# Altium project charging-module.PrjPcb
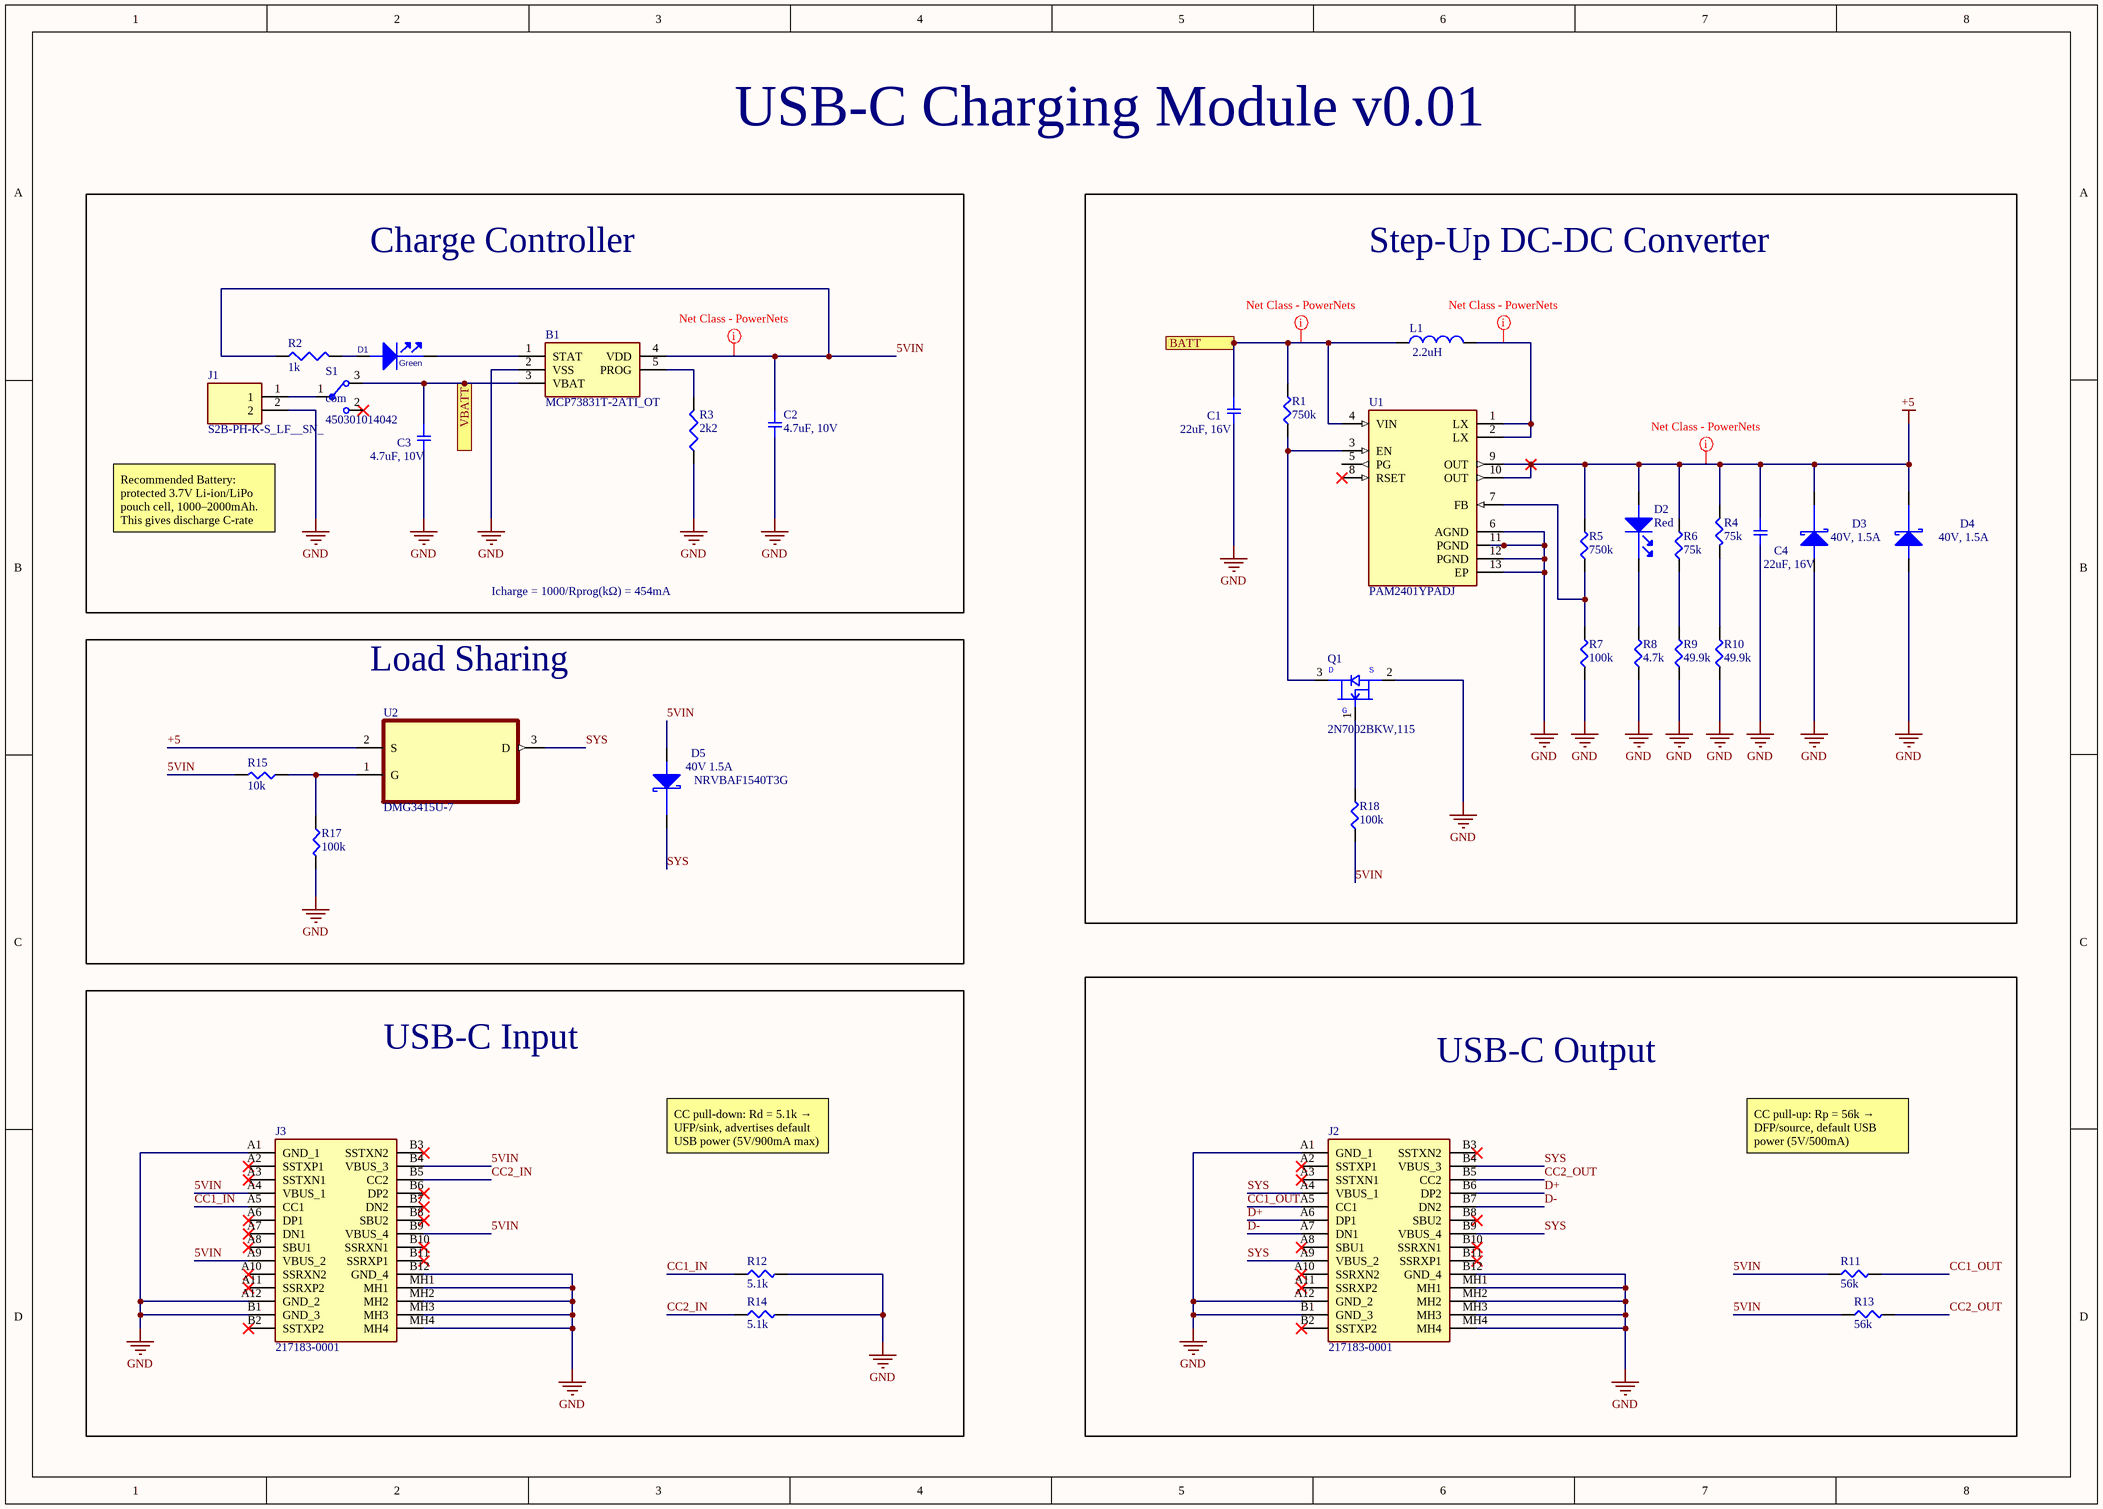
[diagram p0: charging-module.SchDoc]
1 sheet, 35 parts. Net scope: flat (ports and power ports of the same name join across sheets).
Board file: charging-module.PcbDoc

## Sheet charging-module.SchDoc
size A3; SheetNumber: 1; SheetTotal: 1

### Parts
B1  MCP73831T-2ATI_OT  [SOT95P270X145-5N]
C1  22uF, 16V  [SMD-1206C]
C2  4.7uF, 10V  [SMD-0603C]
C3  4.7uF, 10V  [SMD-0603C]
C4  22uF, 16V  [SMD-1206C]
D1  Green  [LED_0603]
D2  Red  [LED_0603]
D3  40V, 1.5A  [SMC]
D4  40V, 1.5A  [SMC]
D5  40V 1.5A  Supplier Part Number 1: NRVBAF1540T3G  [SMC]
J1  S2B-PH-K-S_LF__SN_  [SHDRRA2W50P0X200_1X2_590X760X480P]
J2  217183-0001  [2171830001]
J3  217183-0001  [2171830001]
L1  2.2uH  [INDPM7265X300N]
Q1  2N7002BKW,115  [SC70_SOT323]
R1  750k  [SMD-0402-RES]
R2  1k  [R0402]
R3  2k2  [R0402]
R4  75k  [SMD-0603-RES]
R5  750k  [SMD-0402-RES]
R6  75k  [SMD-0603-RES]
R7  100k  [SMD-0603-RES]
R8  4.7k  [SMD-0603-RES]
R9  49.9k  [SMD-0603-RES]
R10  49.9k  [SMD-0603-RES]
R11  56k  [SMD-0402-RES]
R12  5.1k  [R0402]
R13  56k  [SMD-0402-RES]
R14  5.1k  [R0402]
R15  10k  [SMD-0201-RES]
R17  100k  [SMD-0603-RES]
R18  100k  [SMD-0603-RES]
S1  450301014042  [450301014042]
U1  PAM2401YPADJ  [SON45P300X300X63-13N]
U2  DMG3415U-7  [SOT95P240X105-3N]

### Blocks framed on the sheet
Charge Controller: B1 C2 C3 D1 J1 R2 R3 S1
Step-Up DC-DC Converter: C1 C4 D2-D4 L1 Q1 R1 R4-R10 R18 U1
Load Sharing: D5 R15 R17 U2
USB-C Input: J3 R12 R14
USB-C Output: J2 R11 R13

### Ports
BATT, VBATT

### Nets
+5: C4.1 D2.2(ANODE) D3.1(cathode) D4.1(cathode) R4.1 R5.2 R6.2 U1.9(OUT) U1.10(OUT) U2.2(S)
GND: B1.2(VSS) C1.2 C2.2 C3.2 C4.2 D3.2(ANODE) D4.2(ANODE) J1.2 J2.A1(GND_1) J2.A12(GND_2) J2.B1(GND_3) J2.B12(GND_4) J2.MH1 J2.MH2 J2.MH3 J2.MH4 J3.A1(GND_1) J3.A12(GND_2) J3.B1(GND_3) J3.B12(GND_4) J3.MH1 J3.MH2 J3.MH3 J3.MH4 Q1.2(SOURCE) R3.1 R7.1 R8.1 R9.1 R10.1 R12.2 R14.2 R17.2 U1.6(AGND) U1.11(PGND) U1.12(PGND) U1.13(EP)
5VIN: B1.4(VDD) C2.1 D5.2(ANODE) J3.A4(VBUS_1) J3.A9(VBUS_2) J3.B4(VBUS_3) J3.B9(VBUS_4) R2.1 R11.1 R13.1 R15.2 R18.1
CC1_IN: J3.A5(CC1) R12.1
CC1_OUT: J2.A5(CC1) R11.2
CC2_IN: J3.B5(CC2) R14.1
CC2_OUT: J2.B5(CC2) R13.2
D+: J2.A6(DP1) J2.B6(DP2)
D-: J2.A7(DN1) J2.B7(DN2)
SYS: D5.1(cathode) J2.A4(VBUS_1) J2.A9(VBUS_2) J2.B4(VBUS_3) J2.B9(VBUS_4) U2.3(D)
NetB1_1: B1.1(STAT) D1.1(cathode)
NetB1_3: B1.3(VBAT) C3.1 S1.3 ; port VBATT
NetB1_5: B1.5(PROG) R3.2
NetC1_1: C1.1 L1.1 R1.2 U1.4(VIN) ; port BATT
NetD1_2: D1.2(ANODE) R2.2
NetD2_1: D2.1(cathode) R8.2
NetJ1_1: J1.1 S1.1
NetL1_2: L1.2 U1.1(LX) U1.2(LX)
NetQ1_1: Q1.1(GATE) R18.2
NetQ1_3: Q1.3(DRAIN) R1.1 U1.3(EN)
NetR4_2: R4.2 R10.2
NetR5_1: R5.1 R7.2 U1.7(FB)
NetR6_1: R6.1 R9.2
NetR15_1: R15.1 R17.1 U2.1(G)

Not connected (* = marked no-connect by the designer): J2 A2(SSTXP1)* A3(SSTXN1)* A8(SBU1)* A10(SSRXN2)* A11(SSRXP2)* B2(SSTXP2)* B3(SSTXN2)* B8(SBU2)* B10(SSRXN1)* B11(SSRXP1)*; J3 A2(SSTXP1)* A3(SSTXN1)* A6(DP1)* A7(DN1)* A8(SBU1)* A10(SSRXN2)* A11(SSRXP2)* B2(SSTXP2)* B3(SSTXN2)* B6(DP2)* B7(DN2)* B8(SBU2)* B10(SSRXN1)* B11(SSRXP1)*; S1 2*; U1 5(PG) 8(RSET)*

### Layout directives
mark named Net Class - PowerNets: 5VIN, +5, NetC1_1, NetL1_2

### Notes on the sheet
- USB-C Charging Module v0.01
- Recommended Battery: protected 3.7V Li-ion/LiPo pouch cell, 1000–2000mAh. This gives discharge C-rate around 0.75C to 1.5C
- Icharge = 1000/Rprog(kΩ) = 454mA
- CC pull-down: Rd = 5.1k → UFP/sink, advertises default USB power (5V/900mA max)
- CC pull-up: Rp = 56k → DFP/source, default USB power (5V/500mA)
- (in symbol 2N7002BKW,115) D; S; G
- (in symbol 450301014042) com

### Library data of the parts
B1 = MCP73831T-2ATI_OT: Microchip MCP73831T-2ATI/OT, Battery Charge Controller Lithium-Ion/Polymer, 500mA, 5-pin SOT-23; Geometry.Height: 1.45mm; Manufacturer_Name: Microchip; Manufacturer_Part_Number: MCP73831T-2ATI/OT; Mouser Part Number: 579-MCP73831T-2ATIOT; Mouser Price/Stock: https://www.mouser.co.uk/ProductDetail/Microchip-Technology/MCP73831T-2ATI-OT?qs=yUQqVecv4qsZbioEUu%252B83g%3D%3D; Arrow Part Number: MCP73831T-2ATI/OT; Arrow Price/Stock: https://www.arrow.com/en/products/mcp73831t-2atiot_2/microchip-technology.html?utm_currency=USD&region=nac; Datasheet Link: https://datasheet.datasheetarchive.com/originals/distributors/Datasheets-DGA15/727147.pdf
C1 C4 = GRM319R61C226ME15D: CAP CER 22UF 16V X5R 1206; Manufacturer: Murata Electronics North America; Factory Stock: 0; Unit Price (USD): 0.53; Minimum Quantity: 1; Value: 22µF; Tolerance: ±20%; Datasheets: http://www.murata.com/~/media/webrenewal/support/library/catalog/products/capacitor/mlcc/c02e.pdf; Image: //media.digikey.com/Renders/Murata%20Renders/GR331BD72E473KW01L.jpg; Digi-Key Part Number: 490-12763-1-ND; Part Number: GRM319R61C226ME15D; Quantity Available: 11850; @ qty: 0; Packaging: Cut Tape (CT); Series: GRM; Part Status: Active; Voltage: 16V; Temperature Coefficient: X5R; Operating Temperature: -55°C ~ 85°C; Features: -; Ratings: -; Applications: General Purpose; Mounting Type: Surface Mount, MLCC; Package / Case: 1206 (3216 Metric); Size / Dimension: 0.126" L x 0.063" W (3.20mm x 1.60mm); Height - Seated (Max): -; Thickness (Max): 0.037" (0.95mm); Lead Spacing: -; Lead Style: -
C2 C3 = GRM188R61A475ME15D: CAP CER 4.7UF 10V X5R 0603; Manufacturer: Murata Electronics North America; Factory Stock: 0; Unit Price (USD): 0.16; Minimum Quantity: 1; Value: 4.7µF; Tolerance: ±20%; Datasheets: http://www.murata.com/~/media/webrenewal/support/library/catalog/products/capacitor/mlcc/c02e.pdf; Image: //media.digikey.com/Renders/Murata%20Renders/ZRB-SERIES-0402.jpg; Digi-Key Part Number: 490-10478-1-ND; Part Number: GRM188R61A475ME15D; Quantity Available: 1695; @ qty: 0; Packaging: Cut Tape (CT); Series: GRM; Part Status: Active; Voltage: 10V; Temperature Coefficient: X5R; Operating Temperature: -55°C ~ 85°C; Features: Derating Recommended; Ratings: -; Applications: General Purpose; Mounting Type: Surface Mount, MLCC; Package / Case: 0603 (1608 Metric); Size / Dimension: 0.063" L x 0.031" W (1.60mm x 0.80mm); Height - Seated (Max): -; Thickness (Max): 0.035" (0.90mm); Lead Spacing: -; Lead Style: -
D1 = LG L29K-G2J1-24-Z: LED SMARTLED GREEN 570NM 0603; Manufacturer: OSRAM Opto Semiconductors Inc; .Checked PCB: used; Current - Test: 2mA; Voltage - Forward (Vf) Typ: 1.7V; Luminous Flux @ Current - Test: 12 mlm; Millicandela Rating: 3.92mcd; Wavelength - Peak: 572nm; Lens Type: Diffused; Lens Style/Size: Rectangle with Flat Top, 1.3mm x 0.8mm; Viewing Angle: 160°; Regulator Topology: Positive Fixed; Voltage - Output: 2.5V; Voltage - Input: 2.6 V ~ 6 V; Voltage - Dropout (Typical): 0.16V @ 500mA; Number of Regulators: 1; Current - Output: 500mA; Current - Limit (Min): 600mA; .Checked SCH: used; Category: Optoelectronics; Supplier Part Number: 475-2709-1-ND; Family: LEDs - <75mA, Discre; Manufacturer Part Number: LG L29K-G2J1-24-Z; Price 1k [$]: 0.08744; Value: Green; Color: Green; Package / Case: 0603 (1608 Metric); Supplier: Digikey; Supplier 1: Digi-Key; Supplier Part Number 1: 475-2709-1-ND; RoHS: RoHS Compliant; Stock 1: 30318; Pricing 1: 1=0.16, 10=0.137, 100=0.1093, 250=0.09564, 500=0.08744 (USD); Wavelength - Dominant: 570nm; Size / Dimension: 1.70mm L x 0.80mm W; Height: 0.65mm; Mounting Type: Surface Mount; Packaging: Cut Tape (CT); ComponentLink1URL: http://catalog.osram-os.com/catalogue/catalogue.do;jsessionid=32CB61882C089EDD4B6D0A54E7E1F117?act=downloadFile&favOid=020000020000138e000100b6; ComponentLink1Description: http://catalog.osram-os.com/catalogue/catalogue.do;jsessionid=32CB61882C089EDD4B6D0A54E7E1F117?act=downloadFile&favOid=020000020000138e000100b6; Operating Temperature: -40°C ~ 125°C; Supplier Device Package: 6-TMLF® (1.6x1.6); ComponentLink2URL: http://www.micrel.com/_PDF/mic5353.pdf; ComponentLink2Description: http://www.micrel.com/_PDF/mic5353.pdf
D2 = LS L29K-H1J2-1-Z: LED SMARTLED RED 630NM 0603 SMD; Manufacturer: OSRAM Opto Semiconductors Inc; Millicandela Rating: 4.95mcd; Voltage - Forward (Vf) Typ: 1.8V; Current - Test: 2mA; Wavelength - Peak: 643nm; Viewing Angle: 160°; Lens Type: Diffused; Lens Style/Size: Rectangle with Flat Top, 1.3mm x 0.8mm; Luminous Flux @ Current - Test: 20 mlm; .Checked PCB: RF; Supplier 1: Digi-Key; Supplier Part Number 1: 475-1195-1-ND; Manufacturer Part Number: LS L29K-H1J2-1-Z; RoHS: RoHS Compliant; Category: Optoelectronics; Stock 1: 71670; Pricing 1: 1=0.16, 10=0.137, 100=0.1093, 250=0.09564, 500=0.08744 (USD); Color: Red; Wavelength - Dominant: 630nm; Package / Case: 0603 (1608 Metric); Size / Dimension: 1.70mm L x 0.80mm W; Height: 0.65mm; Mounting Type: Surface Mount; Packaging: Cut Tape (CT); ComponentLink1URL: http://catalog.osram-os.com/catalogue/catalogue.do;jsessionid=DB7CFDBAC5AF1E216E45F622E867085A?act=downloadFile&favOid=020000010003f9de000100b6; ComponentLink1Description: http://catalog.osram-os.com/catalogue/catalogue.do;jsessionid=DB7CFDBAC5AF1E216E45F622E867085A?act=downloadFile&favOid=020000010003f9de000100b6; .Checked SCH: RF
D3 D4 = B560C-13-F: Rectifier Diode Schottky Si 40V 1.5A Automotive T/R / Surface Mount Schottky Power Rectifier; Manufacturer: onsemi; Manufacturer Part Number: NRVBAF1540T3G; Manufacturer Lifecycle Status: ACTIVE; Forward Voltage: 540mV; Max Forward Surge Current (Ifsm): 40A; Number of Elements: 1; Peak Reverse Current: 800µA; Supplier 1: Avnet; Supplier Part Number 1: NRVBAF1540T3G; RoHS: Compliant; Category: Schottky Diodes; Stock 1: 55000; Pricing 1: 1667=0.38462, 3334=0.37037, 6668=0.36268, 13336=0.36081, 26672=0.35894 (USD); China RoHS: Non-Compliant; Country of Origin: Malaysia; Export Control Classification Number (ECCN) Code: EAR99; Harmonized Tariff Schedule (HTS) Code: 8541.10.00.80; Introduction Date: 2012-07-31; Lifecycle Status: Production; Max Operating Temperature: 150°C; Max Output Current: 1.5A; Min Operating Temperature: -55°C; Number of Terminals: 2; Ratings: AEC-Q101; REACH SVHC: Affected; Reverse Standoff Voltage: 40V; ComponentLink1URL: https://datasheet.octopart.com:443/NRVBAF1540T3G-onsemi-datasheet-180961703.pdf?src-supplier=IHS; ComponentLink1Description: https://datasheet.octopart.com:443/NRVBAF1540T3G-onsemi-datasheet-180961703.pdf?src-supplier=IHS; ComponentLink2URL: https://datasheet.octopart.com:443/NRVBAF1540T3G-ON-Semiconductor-datasheet-102650802.pdf?src-supplier=Master+Electronics; ComponentLink2Description: https://datasheet.octopart.com:443/NRVBAF1540T3G-ON-Semiconductor-datasheet-102650802.pdf?src-supplier=Master+Electronics; ComponentLink3URL: https://datasheet.octopart.com:443/NRVBAF1540T3G-ON-Semiconductor-datasheet-37175836.pdf?src-supplier=onsemi; ComponentLink3Description: https://datasheet.octopart.com:443/NRVBAF1540T3G-ON-Semiconductor-datasheet-37175836.pdf?src-supplier=onsemi; ComponentLink4URL: http://sigma.octopart.com:80/150627557/rohs_statement/ON-Semiconductor-NRVBAF1540T3G.pdf?src-supplier=Compliance+Statements; ComponentLink4Description: http://sigma.octopart.com:80/150627557/rohs_statement/ON-Semiconductor-NRVBAF1540T3G.pdf?src-supplier=Compliance+Statements; ComponentLink5URL: http://sigma.octopart.com:80/reach_statement/ON-Semiconductor-company-79.pdf?src-supplier=Compliance+Statements; ComponentLink5Description: http://sigma.octopart.com:80/reach_statement/ON-Semiconductor-company-79.pdf?src-supplier=Compliance+Statements; ComponentLink6URL: https://octopart.com:443/opatz8j6/c1?t=SiboxA2vrICSTk_l2maHCDShWHIi_dnvigSOZqUHEWaRMvBFReFfca-ylV2CfBx60NhopUrlbyUfRb0plhK-rDPZJyxJxBvxECjt7U7pX7TXlL1SXtdatVkAjRijYWHia9PvJf6JO-B6pW5cd2TM4srDPegS9EfEUBXkl2e3Vaz4coYvZ5nhW3awRsHlcCyVf5VFJ1EC1fo8-dBxiQb4xV6d213PwR75c_p2Ue5i0AEO_byktMF-82G6jzb2U9pCWOdbcfvpOlxRzmFo7F-uhTTYaGlpuO0YpZojM7WbysfqBZwesdMxqHVpz_SBT9MUnua2eTadQMhvopnjSfcY5pgeaA0LWl9iNhrN_nKdj2nm&src-supplier=Compliance+Statements; ComponentLink6Description: https://octopart.com:443/opatz8j6/c1?t=SiboxA2vrICSTk_l2maHCDShWHIi_dnvigSOZqUHEWaRMvBFReFfca-ylV2CfBx60NhopUrlbyUfRb0plhK-rDPZJyxJxBvxECjt7U7pX7TXlL1SXtdatVkAjRijYWHia9PvJf6JO-B6pW5cd2TM4srDPegS9EfEUBXkl2e3Vaz4coYvZ5nhW3awRsHlcCyVf5VFJ1EC1fo8-dBxiQb4xV6d213PwR75c_p2Ue5i0AEO_byktMF-82G6jzb2U9pCWOdbcfvpOlxRzmFo7F-uhTTYaGlpuO0YpZojM7WbysfqBZwesdMxqHVpz_SBT9MUnua2eTadQMhvopnjSfcY5pgeaA0LWl9iNhrN_nKdj2nm&src-supplier=Compliance+Statements; ComponentLink7URL: https://octopart.com:443/opatz8j6/c1?t=z02q9_x8Us9miko2EDE-luFaRUgcFcVlGAZ_FKVO_QydFW-tKxnMIeR7YIu_UOiXmvAZ45QGgIjcJpalewf3gTmZB6TpoAGva3q68axi7AfK3u1it3nY6HTm8t56JWb4ylWl5mf-Yw1OF6XhZBLBAu0nhZhfPx-6ARupAi6Zp2Q-ljtD1tp4sd0Oxm5olO9ySHjrEB2Nk_IBathEl-5nniyTMcF1q7gAQIUx_ss9NQHKld3CCWBWNOq8a3no0ZPsn8talKA5fqkSjfvXyiHWYLNaa3_PGx8jTK7uAfQ3U7GTw7YhHTil9VR_eHs_IfGCqzxzvH-QuAqEotszV84Rdfjhjx15A-DOV_4hHkZhFa9bvA&src-supplier=Compliance+Statements; ComponentLink7Description: https://octopart.com:443/opatz8j6/c1?t=z02q9_x8Us9miko2EDE-luFaRUgcFcVlGAZ_FKVO_QydFW-tKxnMIeR7YIu_UOiXmvAZ45QGgIjcJpalewf3gTmZB6TpoAGva3q68axi7AfK3u1it3nY6HTm8t56JWb4ylWl5mf-Yw1OF6XhZBLBAu0nhZhfPx-6ARupAi6Zp2Q-ljtD1tp4sd0Oxm5olO9ySHjrEB2Nk_IBathEl-5nniyTMcF1q7gAQIUx_ss9NQHKld3CCWBWNOq8a3no0ZPsn8talKA5fqkSjfvXyiHWYLNaa3_PGx8jTK7uAfQ3U7GTw7YhHTil9VR_eHs_IfGCqzxzvH-QuAqEotszV84Rdfjhjx15A-DOV_4hHkZhFa9bvA&src-supplier=Compliance+Statements
D5 = B560C-13-F: Rectifier Diode Schottky Si 40V 1.5A Automotive T/R / Surface Mount Schottky Power Rectifier; Manufacturer: onsemi; Manufacturer Lifecycle Status: ACTIVE; Forward Voltage: 540mV; Max Forward Surge Current (Ifsm): 40A; Number of Elements: 1; Peak Reverse Current: 800µA; Supplier 1: Avnet; Manufacturer Part Number: NRVBAF1540T3G; RoHS: Compliant; Category: Schottky Diodes; Stock 1: 55000; Pricing 1: 1667=0.38462, 3334=0.37037, 6668=0.36268, 13336=0.36081, 26672=0.35894 (USD); China RoHS: Non-Compliant; Country of Origin: Malaysia; Export Control Classification Number (ECCN) Code: EAR99; Harmonized Tariff Schedule (HTS) Code: 8541.10.00.80; Introduction Date: 2012-07-31; Lifecycle Status: Production; Max Operating Temperature: 150°C; Max Output Current: 1.5A; Min Operating Temperature: -55°C; Number of Terminals: 2; Ratings: AEC-Q101; REACH SVHC: Affected; Reverse Standoff Voltage: 40V; ComponentLink1URL: https://datasheet.octopart.com:443/NRVBAF1540T3G-onsemi-datasheet-180961703.pdf?src-supplier=IHS; ComponentLink1Description: https://datasheet.octopart.com:443/NRVBAF1540T3G-onsemi-datasheet-180961703.pdf?src-supplier=IHS; ComponentLink2URL: https://datasheet.octopart.com:443/NRVBAF1540T3G-ON-Semiconductor-datasheet-102650802.pdf?src-supplier=Master+Electronics; ComponentLink2Description: https://datasheet.octopart.com:443/NRVBAF1540T3G-ON-Semiconductor-datasheet-102650802.pdf?src-supplier=Master+Electronics; ComponentLink3URL: https://datasheet.octopart.com:443/NRVBAF1540T3G-ON-Semiconductor-datasheet-37175836.pdf?src-supplier=onsemi; ComponentLink3Description: https://datasheet.octopart.com:443/NRVBAF1540T3G-ON-Semiconductor-datasheet-37175836.pdf?src-supplier=onsemi; ComponentLink4URL: http://sigma.octopart.com:80/150627557/rohs_statement/ON-Semiconductor-NRVBAF1540T3G.pdf?src-supplier=Compliance+Statements; ComponentLink4Description: http://sigma.octopart.com:80/150627557/rohs_statement/ON-Semiconductor-NRVBAF1540T3G.pdf?src-supplier=Compliance+Statements; ComponentLink5URL: http://sigma.octopart.com:80/reach_statement/ON-Semiconductor-company-79.pdf?src-supplier=Compliance+Statements; ComponentLink5Description: http://sigma.octopart.com:80/reach_statement/ON-Semiconductor-company-79.pdf?src-supplier=Compliance+Statements; ComponentLink6URL: https://octopart.com:443/opatz8j6/c1?t=SiboxA2vrICSTk_l2maHCDShWHIi_dnvigSOZqUHEWaRMvBFReFfca-ylV2CfBx60NhopUrlbyUfRb0plhK-rDPZJyxJxBvxECjt7U7pX7TXlL1SXtdatVkAjRijYWHia9PvJf6JO-B6pW5cd2TM4srDPegS9EfEUBXkl2e3Vaz4coYvZ5nhW3awRsHlcCyVf5VFJ1EC1fo8-dBxiQb4xV6d213PwR75c_p2Ue5i0AEO_byktMF-82G6jzb2U9pCWOdbcfvpOlxRzmFo7F-uhTTYaGlpuO0YpZojM7WbysfqBZwesdMxqHVpz_SBT9MUnua2eTadQMhvopnjSfcY5pgeaA0LWl9iNhrN_nKdj2nm&src-supplier=Compliance+Statements; ComponentLink6Description: https://octopart.com:443/opatz8j6/c1?t=SiboxA2vrICSTk_l2maHCDShWHIi_dnvigSOZqUHEWaRMvBFReFfca-ylV2CfBx60NhopUrlbyUfRb0plhK-rDPZJyxJxBvxECjt7U7pX7TXlL1SXtdatVkAjRijYWHia9PvJf6JO-B6pW5cd2TM4srDPegS9EfEUBXkl2e3Vaz4coYvZ5nhW3awRsHlcCyVf5VFJ1EC1fo8-dBxiQb4xV6d213PwR75c_p2Ue5i0AEO_byktMF-82G6jzb2U9pCWOdbcfvpOlxRzmFo7F-uhTTYaGlpuO0YpZojM7WbysfqBZwesdMxqHVpz_SBT9MUnua2eTadQMhvopnjSfcY5pgeaA0LWl9iNhrN_nKdj2nm&src-supplier=Compliance+Statements; ComponentLink7URL: https://octopart.com:443/opatz8j6/c1?t=z02q9_x8Us9miko2EDE-luFaRUgcFcVlGAZ_FKVO_QydFW-tKxnMIeR7YIu_UOiXmvAZ45QGgIjcJpalewf3gTmZB6TpoAGva3q68axi7AfK3u1it3nY6HTm8t56JWb4ylWl5mf-Yw1OF6XhZBLBAu0nhZhfPx-6ARupAi6Zp2Q-ljtD1tp4sd0Oxm5olO9ySHjrEB2Nk_IBathEl-5nniyTMcF1q7gAQIUx_ss9NQHKld3CCWBWNOq8a3no0ZPsn8talKA5fqkSjfvXyiHWYLNaa3_PGx8jTK7uAfQ3U7GTw7YhHTil9VR_eHs_IfGCqzxzvH-QuAqEotszV84Rdfjhjx15A-DOV_4hHkZhFa9bvA&src-supplier=Compliance+Statements; ComponentLink7Description: https://octopart.com:443/opatz8j6/c1?t=z02q9_x8Us9miko2EDE-luFaRUgcFcVlGAZ_FKVO_QydFW-tKxnMIeR7YIu_UOiXmvAZ45QGgIjcJpalewf3gTmZB6TpoAGva3q68axi7AfK3u1it3nY6HTm8t56JWb4ylWl5mf-Yw1OF6XhZBLBAu0nhZhfPx-6ARupAi6Zp2Q-ljtD1tp4sd0Oxm5olO9ySHjrEB2Nk_IBathEl-5nniyTMcF1q7gAQIUx_ss9NQHKld3CCWBWNOq8a3no0ZPsn8talKA5fqkSjfvXyiHWYLNaa3_PGx8jTK7uAfQ3U7GTw7YhHTil9VR_eHs_IfGCqzxzvH-QuAqEotszV84Rdfjhjx15A-DOV_4hHkZhFa9bvA&src-supplier=Compliance+Statements
J1 = S2B-PH-K-S_LF__SN_: PH-2.0mm Header side entry 2 way JST PH Series, Series Number S2B, 2mm Pitch 2 Way 1 Row Right Angle PCB Header, Through Hole Termination, 2A; Manufacturer_Name: JST (JAPAN SOLDERLESS TERMINALS); Manufacturer_Part_Number: S2B-PH-K-S(LF)(SN); Geometry.Height: 4.8mm; Mouser Part Number: 306-S2BPHKSLFSNPP; Mouser Price/Stock: https://www.mouser.co.uk/ProductDetail/JST-Commercial/S2B-PH-K-SLFSN?qs=cdbOS8ANM9A5Ie4gXeMjTA%3D%3D; Arrow Part Number: S2B-PH-K-S(LF)(SN); Arrow Price/Stock: https://www.arrow.com/en/products/s2b-ph-k-s-lf-sn/jst-manufacturing.html?utm_currency=USD&region=europe; Datasheet Link: http://uk.rs-online.com/web/p/products/8201494
J2 J3 = 217183-0001: Connector USB Type C Hybrid Female 24Positions 0.5mm Right Angle Through Hole Embossed T/R; Manufacturer_Name: Molex; Geometry.Height: 3.36mm; Manufacturer_Part_Number: 217183-0001; Mouser Part Number: 538-217183-0001; Mouser Price/Stock: https://www.mouser.co.uk/ProductDetail/Molex/217183-0001?qs=DRkmTr78QAQVjf9fqpgsow%3D%3D; Arrow Part Number: *; Arrow Price/Stock: *; Datasheet Link: https://www.molex.com/pdm_docs/sd/2171830001_sd.pdf
L1 = Inductor: Inductor Power Shielded Wirewound 2.2uH 20% 1MHz Metal 6.8A 0.0193Ohm DCR T/R; Manufacturer: Sumida; Manufacturer Part Number: CDMC6D28NP-2R2MC; Core Material: Composite, Metal; Current Rating: 6A; DC Resistance (DCR): 19.3mΩ; Inductance: 2.2µH; Max DC Current: 7.6A; Number of Circuits: 1; Supplier 1: DigiKey; Supplier Part Number 1: 308-1569-1-ND; RoHS: Compliant; Category: Fixed Inductors; Stock 1: 167; Pricing 1: 1=0.95, 10=0.777, 25=0.7192, 50=0.6778, 100=0.6391 (USD); Case/Package: Nonstandard; DC Current: 6.8A; Depth: 6.7mm; Export Control Classification Number (ECCN) Code: EAR99; Height: 3mm; Height - Seated (Max): 2.9972mm; Harmonized Tariff Schedule (HTS) Code: 8504.50.80.00; Introduction Date: 2008-01-30; Lead Free: Lead Free; Length: 7.25mm; Lifecycle Status: Obsolete; LTB Date: 2025-12-31; LTD Date: 2026-04-30; Max Current Rating: 6A; Max Operating Temperature: 125°C; Military Standard: Not; Min Operating Temperature: -40°C; Mount: Surface Mount; Number of Terminals: 2; Packaging: Digi-Reel®; Radiation Hardening: No; Saturation Current: 6A; Schedule B: 8504500000, 8504500000|8504500000|8504500000|8504500000|8504500000; Shielding: Shielded; Termination: SMD/SMT; Test Frequency: 1MHz; Tolerance: 20%; Width: 6.5mm; ComponentLink1URL: https://datasheet.octopart.com:443/CDMC6D28NP-2R2MC-Sumida-datasheet-181250798.pdf?src-supplier=IHS; ComponentLink1Description: https://datasheet.octopart.com:443/CDMC6D28NP-2R2MC-Sumida-datasheet-181250798.pdf?src-supplier=IHS; ComponentLink2URL: https://datasheet.octopart.com:443/CDMC6D28NP-2R2MC-Sumida-datasheet-12515277.pdf?src-supplier=_legacy+Avnet; ComponentLink2Description: https://datasheet.octopart.com:443/CDMC6D28NP-2R2MC-Sumida-datasheet-12515277.pdf?src-supplier=_legacy+Avnet; ComponentLink3URL: https://datasheet.octopart.com:443/CDMC6D28NP-2R2MC-Sumida-datasheet-8324284.pdf?src-supplier=_legacy+Avnet; ComponentLink3Description: https://datasheet.octopart.com:443/CDMC6D28NP-2R2MC-Sumida-datasheet-8324284.pdf?src-supplier=_legacy+Avnet; ComponentLink4URL: https://datasheet.octopart.com:443/CDMC6D28NP-2R2MC-Sumida-datasheet-32609285.pdf?src-supplier=Future+Electronics; ComponentLink4Description: https://datasheet.octopart.com:443/CDMC6D28NP-2R2MC-Sumida-datasheet-32609285.pdf?src-supplier=Future+Electronics
Q1 = 2N7002BKW,115: MOSFET N-CH 60V 310MA SOT323; Manufacturer: NXP Semiconductors; FET Type: MOSFET N-Channel, Metal Oxide; FET Feature: Logic Level Gate; Rds On (Max) @ Id, Vgs: 1.6 Ohm @ 500mA, 10V; Vgs(th) (Max) @ Id: 2.1V @ 250µA; Gate Charge (Qg) @ Vgs: 0.6nC @ 4.5V; Input Capacitance (Ciss) @ Vds: 50pF @ 10V; Power - Max: 275mW; .Checked PCB: RF; Supplier 1: Digi-Key; Supplier Part Number 1: 568-5980-1-ND; Manufacturer Part Number: 2N7002BKW,115; RoHS: RoHS Compliant; Category: Discrete Semiconductor Products; Stock 1: 15666; Pricing 1: 1=0.39, 10=0.354, 25=0.2548, 100=0.1983, 250=0.12456, 500=0.10616, 1000=0.07233 (USD); Drain to Source Voltage (Vdss): 60V; Current - Continuous Drain (Id) @ 25° C: 310mA; Mounting Type: Surface Mount; Package / Case: SC-70, SOT-323; Supplier Device Package: SC-70; Packaging: Cut Tape (CT); ComponentLink1URL: http://www.nxp.com/documents/data_sheet/2N7002BKW.pdf; ComponentLink1Description: http://www.nxp.com/documents/data_sheet/2N7002BKW.pdf; .Checked SCH: RF
R1 R5 = ERJ-2RKF7503X: RES SMD 750K OHM 1% 1/10W 0402; Manufacturer: Panasonic Electronic Components; Factory Stock: 0; Unit Price (USD): 0.00496; @ qty: 1500; Minimum Quantity: 1; Power (Watts): 0.1W, 1/10W; Temperature Coefficient: ±100ppm/°C; Part Number: ERJ-2RKF7503X; Datasheets: http://industrial.panasonic.com/www-cgi/jvcr13pz.cgi?E+PZ+3+AOA0002+ERJ2RKF7503X+7+WW; Image: //media.digikey.com/Photos/Panasonic%20Photos/ERJ-PA2-Series.jpg; Digi-Key Part Number: P750KLCT-ND; Quantity Available: 78807; Packaging: Cut Tape (CT); Series: ERJ; Part Status: Active; Value: 750k; Tolerance: ±1%; Composition: Thick Film; Features: Automotive AEC-Q200; Operating Temperature: -55°C ~ 155°C; Package / Case: 0402 (1005 Metric); Supplier Device Package: 0402; Size / Dimension: 0.039" L x 0.020" W (1.00mm x 0.50mm); Height - Seated (Max): 0.016" (0.40mm); Number of Terminations: 2; Failure Rate: -
R2 = RC0402FR-071KL: RES 1.00K OHM 1/16W 1% 0402 SMD; Manufacturer: Yageo; Power (Watts): 0.063W, 1/16W; .Checked PCB: used; Temperature Coefficient: ±100ppm/°C; Category: Resistors; Supplier Part Number: 311-1.00KLRCT-ND; Manufacturer Part Number: RC0402FR-071KL; Package / Case: 0402 (1005 Metric); Price 1k [$]: 0.01421; Resistance (Ohms): 1K; Tolerance: ±1%; Value: 1k; .Checked SCH: used; Supplier: Digikey; Supplier 1: Digi-Key; Supplier Part Number 1: 311-1.00KLRCT-ND; RoHS: RoHS Compliant; Stock 1: 1753477; Pricing 1: 10=0.014, 50=0.0104, 100=0.0079, 250=0.00584, 500=0.00432, 1000=0.00288 (USD); Composition: Thick Film; Features: -; Size / Dimension: 0.039" L x 0.020" W (1.00mm x 0.50mm); Height: 0.016" (0.40mm); Number of Terminations: 2; Packaging: Cut Tape (CT); ComponentLink1URL: http://www.yageo.com/documents/recent/PYu-RC0402_51_RoHS_L_6.pdf; ComponentLink1Description: http://www.yageo.com/documents/recent/PYu-RC0402_51_RoHS_L_6.pdf
R3 = RC0402FR-072K2L: RES 2.20K OHM 1/16W 1% 0402 SMD; Manufacturer: Yageo; Resistance (Ohms): 2.2K; Power (Watts): 0.063W, 1/16W; .Checked PCB: used; Temperature Coefficient: ±100ppm/°C; Category: Resistors; Supplier Part Number: 311-2.20KLRCT-ND; Manufacturer Part Number: RC0402FR-072K2L; Package / Case: 0402 (1005 Metric); Price 1k [$]: 0.01421; Tolerance: ±1%; Value: 2k2; .Checked SCH: used; Supplier: Digikey; Supplier 1: Digi-Key; Supplier Part Number 1: 311-2.20KLRCT-ND; RoHS: RoHS Compliant; Stock 1: 195154; Pricing 1: 10=0.014, 50=0.0104, 100=0.0079, 250=0.00584, 500=0.00432, 1000=0.00288 (USD); Composition: Thick Film; Features: -; Size / Dimension: 0.039" L x 0.020" W (1.00mm x 0.50mm); Height: 0.016" (0.40mm); Number of Terminations: 2; Packaging: Cut Tape (CT); ComponentLink1URL: http://www.yageo.com/documents/recent/PYu-RC0402_51_RoHS_L_6.pdf; ComponentLink1Description: http://www.yageo.com/documents/recent/PYu-RC0402_51_RoHS_L_6.pdf
R4 R6 = ERJ-3EKF7502V: RES SMD 75K OHM 1% 1/10W 0603; Manufacturer: Panasonic Electronic Components; Factory Stock: 0; Unit Price (USD): 0.00379; @ qty: 1500; Minimum Quantity: 1; Power (Watts): 0.1W, 1/10W; Temperature Coefficient: ±100ppm/°C; Part Number: ERJ-3EKF7502V; Datasheets: http://industrial.panasonic.com/www-cgi/jvcr13pz.cgi?E+PZ+3+AOA0002+ERJ3EKF7502V+7+WW; Image: //media.digikey.com/Photos/Panasonic%20Photos/MFG_ERJ-P6W%20Series.jpg; Digi-Key Part Number: P75.0KHCT-ND; Quantity Available: 63796; Packaging: Cut Tape (CT); Series: ERJ; Part Status: Active; Value: 75k; Tolerance: ±1%; Composition: Thick Film; Features: Automotive AEC-Q200; Operating Temperature: -55°C ~ 155°C; Package / Case: 0603 (1608 Metric); Supplier Device Package: 0603; Size / Dimension: 0.063" L x 0.031" W (1.60mm x 0.80mm); Height - Seated (Max): 0.022" (0.55mm); Number of Terminations: 2; Failure Rate: -
R7 R17 R18 = ERJ-3EKF1003V: RES SMD 100K OHM 1% 1/10W 0603; Manufacturer: Panasonic Electronic Components; Factory Stock: 0; Unit Price (USD): 0.00379; @ qty: 1500; Minimum Quantity: 1; Power (Watts): 0.1W, 1/10W; Temperature Coefficient: ±100ppm/°C; Part Number: ERJ-3EKF1003V; Datasheets: http://industrial.panasonic.com/www-cgi/jvcr13pz.cgi?E+PZ+3+AOA0002+ERJ3EKF1003V+7+WW; Image: //media.digikey.com/Photos/Panasonic%20Photos/MFG_ERJ-P6W%20Series.jpg; Digi-Key Part Number: P100KHCT-ND; Quantity Available: 2179804; Packaging: Cut Tape (CT); Series: ERJ; Part Status: Active; Value: 100k; Tolerance: ±1%; Composition: Thick Film; Features: Automotive AEC-Q200; Operating Temperature: -55°C ~ 155°C; Package / Case: 0603 (1608 Metric); Supplier Device Package: 0603; Size / Dimension: 0.063" L x 0.031" W (1.60mm x 0.80mm); Height - Seated (Max): 0.022" (0.55mm); Number of Terminations: 2; Failure Rate: -
R8 = ERJ-3EKF4701V: RES SMD 4.7K OHM 1% 1/10W 0603; Manufacturer: Panasonic Electronic Components; Factory Stock: 0; Unit Price (USD): 0.00379; @ qty: 1500; Minimum Quantity: 1; Power (Watts): 0.1W, 1/10W; Temperature Coefficient: ±100ppm/°C; Part Number: ERJ-3EKF4701V; Datasheets: http://industrial.panasonic.com/www-cgi/jvcr13pz.cgi?E+PZ+3+AOA0002+ERJ3EKF4701V+7+WW; Image: //media.digikey.com/Photos/Panasonic%20Photos/MFG_ERJ-P6W%20Series.jpg; Digi-Key Part Number: P4.70KHCT-ND; Quantity Available: 999380; Packaging: Cut Tape (CT); Series: ERJ; Part Status: Active; Value: 4.7k; Tolerance: ±1%; Composition: Thick Film; Features: Automotive AEC-Q200; Operating Temperature: -55°C ~ 155°C; Package / Case: 0603 (1608 Metric); Supplier Device Package: 0603; Size / Dimension: 0.063" L x 0.031" W (1.60mm x 0.80mm); Height - Seated (Max): 0.022" (0.55mm); Number of Terminations: 2; Failure Rate: -
R9 R10 = ERJ-3EKF4992V: RES SMD 49.9K OHM 1% 1/10W 0603; Manufacturer: Panasonic Electronic Components; Factory Stock: 0; Unit Price (USD): 0.00379; @ qty: 1500; Minimum Quantity: 1; Power (Watts): 0.1W, 1/10W; Temperature Coefficient: ±100ppm/°C; Part Number: ERJ-3EKF4992V; Datasheets: http://industrial.panasonic.com/www-cgi/jvcr13pz.cgi?E+PZ+3+AOA0002+ERJ3EKF4992V+7+WW; Image: //media.digikey.com/Photos/Panasonic%20Photos/MFG_ERJ-P6W%20Series.jpg; Digi-Key Part Number: P49.9KHCT-ND; Quantity Available: 951405; Packaging: Cut Tape (CT); Series: ERJ; Part Status: Active; Value: 49.9k; Tolerance: ±1%; Composition: Thick Film; Features: Automotive AEC-Q200; Operating Temperature: -55°C ~ 155°C; Package / Case: 0603 (1608 Metric); Supplier Device Package: 0603; Size / Dimension: 0.063" L x 0.031" W (1.60mm x 0.80mm); Height - Seated (Max): 0.022" (0.55mm); Number of Terminations: 2; Failure Rate: -
R11 R13 = ERJ-2GEJ563X: RES SMD 56K OHM 5% 1/10W 0402; Manufacturer: Panasonic Electronic Components; Factory Stock: 0; Unit Price (USD): 0.00350; @ qty: 1500; Minimum Quantity: 1; Power (Watts): 0.1W, 1/10W; Temperature Coefficient: ±200ppm/°C; Part Number: ERJ-2GEJ563X; Datasheets: http://industrial.panasonic.com/www-cgi/jvcr13pz.cgi?E+PZ+3+AOA0001+ERJ2GEJ563X+7+WW; Image: //media.digikey.com/Photos/Panasonic%20Photos/ERJ-PA2-Series.jpg; Digi-Key Part Number: P56KJCT-ND; Quantity Available: 208344; Packaging: Cut Tape (CT); Series: ERJ; Part Status: Active; Value: 56k; Tolerance: ±5%; Composition: Thick Film; Features: Automotive AEC-Q200; Operating Temperature: -55°C ~ 155°C; Package / Case: 0402 (1005 Metric); Supplier Device Package: 0402; Size / Dimension: 0.039" L x 0.020" W (1.00mm x 0.50mm); Height - Seated (Max): 0.016" (0.40mm); Number of Terminations: 2; Failure Rate: -
R12 R14 = ERJ-8ENF5101V: RES SMD 5.1K OHM 1% 1/4W 1206; Manufacturer: Panasonic Electronic Components; Factory Stock: 0; Unit Price (USD): 0.00933; @ qty: 1500; Minimum Quantity: 1; Power (Watts): 0.25W, 1/4W; Temperature Coefficient: ±100ppm/°C; Part Number: ERJ-8ENF5101V; Datasheets: http://industrial.panasonic.com/www-cgi/jvcr13pz.cgi?E+PZ+3+AOA0002+ERJ8ENF5101V+7+WW; Image: //media.digikey.com/Renders/Panasonic%20Renders/ERJ-1206%20Pkg.jpg; Digi-Key Part Number: P5.10KFCT-ND; Quantity Available: 70747; Packaging: Cut Tape (CT); Series: ERJ; Part Status: Active; Value: 5.1k; Tolerance: ±1%; Composition: Thick Film; Features: Automotive AEC-Q200; Operating Temperature: -55°C ~ 155°C; Package / Case: 1206 (3216 Metric); Supplier Device Package: 1206; Size / Dimension: 0.126" L x 0.063" W (3.20mm x 1.60mm); Height - Seated (Max): 0.028" (0.70mm); Number of Terminations: 2; Failure Rate: -
R15 = ERJ-1GEF1002C: RES SMD 10K OHM 1% 1/20W 0201; Manufacturer: Panasonic Electronic Components; Factory Stock: 0; Unit Price (USD): 0.00933; @ qty: 1500; Minimum Quantity: 1; Power (Watts): 0.05W, 1/20W; Temperature Coefficient: ±200ppm/°C; Part Number: ERJ-1GEF1002C; Datasheets: //media.digikey.com/pdf/Data%20Sheets/Panasonic%20Resistors%20Thermistors%20PDFs/ERJ_G,R,E_Rev08.pdf; Image: //media.digikey.com/Renders/Panasonic%20Renders/ERJ-0201%20Pkg.jpg; Digi-Key Part Number: P10.0KABCT-ND; Quantity Available: 2802306; Packaging: Cut Tape (CT); Series: ERJ; Part Status: Active; Value: 10k; Tolerance: ±1%; Composition: Thick Film; Features: -; Operating Temperature: -55°C ~ 125°C; Package / Case: 0201 (0603 Metric); Supplier Device Package: 0201; Size / Dimension: 0.024" L x 0.012" W (0.60mm x 0.30mm); Height - Seated (Max): 0.010" (0.26mm); Number of Terminations: 2; Failure Rate: -
S1 = 450301014042: MF: {'manufacturer': u'W\xfcrth Elektronik'}; Package: None; Price: None; Value: *; MP: 450301014042; Availability: Unavailable
U1 = PAM2401YPADJ: Conv DC-DC 0.9V to 4.75V Synchronous Step Up Single-Out 2.5V to 5V 12-Pin UDFN EP T/R; Manufacturer: Diodes Inc.; Max Switching Frequency: 1MHz; Min Input Voltage: 900mV; Nominal Input Voltage: 3.3V; Number of Circuits: 1; Operating Supply Current: 1µA; Output Configuration: Positive; Output Current: 3A; Output Type: Adjustable; Synchronous Rectifier: Yes; Topology: Boost; Supplier 1: Future Electronics; Supplier Part Number 1: PAM2401YPADJ; Manufacturer Part Number: PAM2401YPADJ; RoHS: Compliant; Category: Voltage Regulators - Switching; Stock 1: 3000; Pricing 1: 3000=0.435, 6000=0.43, 9000=0.425, 15000=0.415 (USD); Case/Package: DFN; China RoHS: Compliant; Height - Seated (Max): 630µm; Length: 3mm; Lifecycle Status: Production; Max Input Voltage: 4.75V; Max Operating Temperature: 85°C; Max Output Voltage: 5V; Min Operating Temperature: -40°C; Min Output Voltage: 2.5V; Min Supply Voltage: 900mV; Mount: Surface Mount; Nominal Output Voltage: 5V; Number of Outputs: 1; Number of Pins: 12; Number of Terminals: 12; Packaging: Tape & Reel (TR); REACH SVHC: Unaffected; Schedule B: 8542390000, 8542390000|8542390000|8542390000|8542390000|8542390000|8542390000|8542390000|8542390000|8542390000|8542390000|8542390000|8542390000|8542390000|8542390000|8542390000|8542390000|8542390000|8542390000|8542390000|8542390000|8542390000|8542390000|8542390000|85; Switching Frequency: 1MHz; Temperature Grade: Industrial; Terminal Pitch: 450µm; Width: 3mm; ComponentLink1URL: https://datasheet.octopart.com:443/PAM2401YPADJ-Diodes-Inc.-datasheet-44660043.pdf?src-supplier=IHS; ComponentLink1Description: https://datasheet.octopart.com:443/PAM2401YPADJ-Diodes-Inc.-datasheet-44660043.pdf?src-supplier=IHS; ComponentLink2URL: https://sigma.octopart.com:443/141243533/technical_drawing/Diodes-Inc.-PAM2401YPADJ.pdf?src-supplier=Diodes+Inc+SCT; ComponentLink2Description: https://sigma.octopart.com:443/141243533/technical_drawing/Diodes-Inc.-PAM2401YPADJ.pdf?src-supplier=Diodes+Inc+SCT
U2 = DMG3415U-7: P-ch Mosfet 20V 4A 39MΩ@4A, 4.5V 9.1NC@4.5V 294PF@10V SOT-23-3 SMD 2.9MM × 1.3MM × 1.03MM; Manufacturer: Diodes Inc.; Drain to Source Breakdown Voltage: -20V; Drain to Source Resistance: 42.5mΩ; Element Configuration: Single; Fall Time: 393ns; Gate to Source Voltage (Vgs): 8V; Input Capacitance: 294pF; Max Junction Temperature (Tj): 150°C; Max Power Dissipation: 900mW; Nominal Vgs: -550mV; Number of Channels: 1; Rds On Max: 39mΩ; Rise Time: 117ns; Turn-Off Delay Time: 795ns; Turn-On Delay Time: 71ns; Supplier 1: Future Electronics; Supplier Part Number 1: DMG3415U-7; Manufacturer Part Number: DMG3415U-7; RoHS: Compliant; Category: MOSFETs; Stock 1: 3000; Pricing 1: 3000=0.151, 6000=0.15, 9000=0.149, 12000=0.148, 15000=0.145 (USD); Case/Package: SOT-23; China RoHS: Compliant; Contact Plating: Tin; Continuous Drain Current (ID): 4A; Drain to Source Voltage (Vdss): -20V; Height: 1.1mm; Lead Free: Lead Free; Length: 2.9mm; Lifecycle Status: NRND; Max Operating Temperature: 150°C; Min Breakdown Voltage: 20V; Min Operating Temperature: -55°C; Mount: Surface Mount; Number of Elements: 1; Number of Pins: 3; Number of Terminals: 3; Packaging: Cut Tape; Power Dissipation: 900mW; Radiation Hardening: No; REACH SVHC: Unaffected; Resistance: 42.5mΩ; Schedule B: 8541210080, 8541210080|8541210080|8541210080|8541210080|8541210080|8541210080|8541210080|8541210080|8541210080|8541210080|8541210080|8541210080|8541210080|8541210080|8541210080|8541210080|8541210080|8541210080|8541210080|8541210080|8541210080|8541210080|8541210080|85; Threshold Voltage: -550mV; Weight: 7.994566mg; Width: 1.3mm; ComponentLink1URL: https://datasheet.octopart.com:443/DMG3415U-7-Diodes-Inc.-datasheet-180552899.pdf?src-supplier=IHS; ComponentLink1Description: https://datasheet.octopart.com:443/DMG3415U-7-Diodes-Inc.-datasheet-180552899.pdf?src-supplier=IHS; ComponentLink2URL: https://datasheet.octopart.com:443/DMG3415U-7-Diodes-Inc.-datasheet-41567333.pdf?src-supplier=Newark; ComponentLink2Description: https://datasheet.octopart.com:443/DMG3415U-7-Diodes-Inc.-datasheet-41567333.pdf?src-supplier=Newark; ComponentLink3URL: https://datasheet.octopart.com:443/DMG3415U-7-Diodes-Inc.-datasheet-12530588.pdf?src-supplier=Newark; ComponentLink3Description: https://datasheet.octopart.com:443/DMG3415U-7-Diodes-Inc.-datasheet-12530588.pdf?src-supplier=Newark; ComponentLink4URL: https://datasheet.octopart.com:443/DMG3415U-7-Diodes-Inc.-datasheet-10027536.pdf?src-supplier=Newark; ComponentLink4Description: https://datasheet.octopart.com:443/DMG3415U-7-Diodes-Inc.-datasheet-10027536.pdf?src-supplier=Newark; ComponentLink5URL: https://sigma.octopart.com:443/138706058/technical_drawing/Diodes-Inc.-DMG3415U-7.pdf?src-supplier=Upverter; ComponentLink5Description: https://sigma.octopart.com:443/138706058/technical_drawing/Diodes-Inc.-DMG3415U-7.pdf?src-supplier=Upverter; ComponentLink6URL: https://datasheet.octopart.com:443/DMG3415U-7-Diodes-Inc.-datasheet-14060167.pdf?src-supplier=iiiC; ComponentLink6Description: https://datasheet.octopart.com:443/DMG3415U-7-Diodes-Inc.-datasheet-14060167.pdf?src-supplier=iiiC; ComponentLink7URL: https://datasheet.octopart.com:443/DMG3415U-7-Diodes-Inc.-datasheet-11766085.pdf?src-supplier=Future+Electronics; ComponentLink7Description: https://datasheet.octopart.com:443/DMG3415U-7-Diodes-Inc.-datasheet-11766085.pdf?src-supplier=Future+Electronics; ComponentLink8URL: http://sigma.octopart.com:80/15540767/rohs_statement/Diodes-Inc.-DMG3415U-7.pdf?src-supplier=Compliance+Statements; ComponentLink8Description: http://sigma.octopart.com:80/15540767/rohs_statement/Diodes-Inc.-DMG3415U-7.pdf?src-supplier=Compliance+Statements